# Altium project MiniKey.PrjPCB
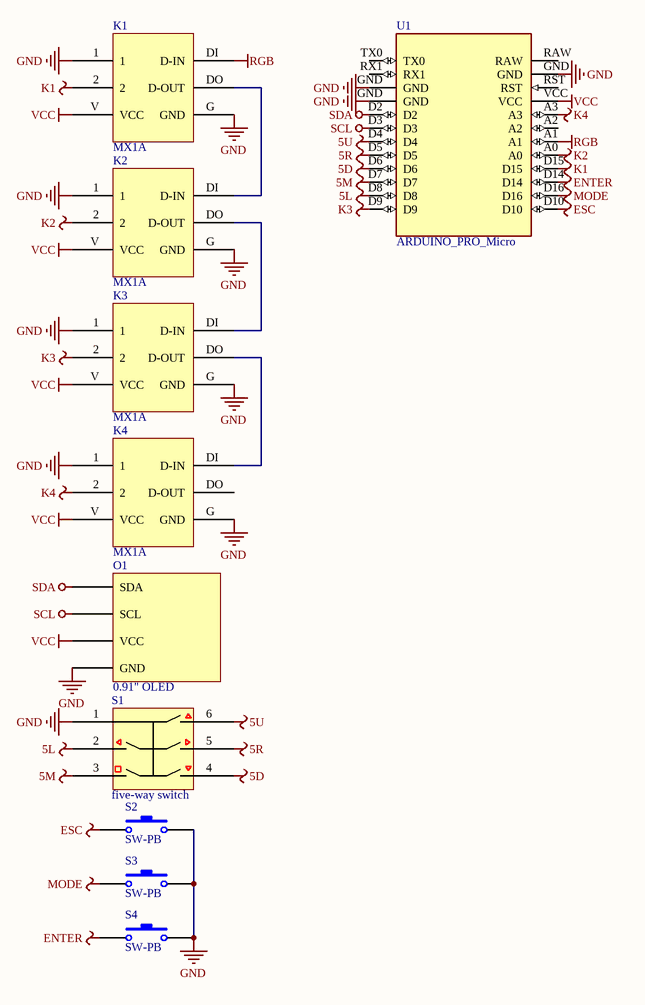
[diagram p0: MiniKey.SchDoc]
1 sheet, 10 parts. Net scope: global (net labels, ports and power ports of the same name join across sheets).
Board file: MiniKey.PcbDoc

## Sheet MiniKey.SchDoc
size A4

### Parts
K1  MX1A  [MX1A]
K2  MX1A  [MX1A]
K3  MX1A  [MX1A]
K4  MX1A  [MX1A]
O1  0.91" OLED  [0.91-OLED]
S1  five-way switch  [five-way switch]
S2  SW-PB  [SW_PB2_A1]
S3  SW-PB  [SW_PB2_A1]
S4  SW-PB  [SW_PB2_A1]
U1  ARDUINO_PRO_Micro  [MODULE_ARDUINO_PRO_MINI]

### Nets
5D: S1.4 U1.D6
5L: S1.2 U1.D8
5M: S1.3 U1.D7
5R: S1.5 U1.D5
5U: S1.6 U1.D4
ENTER: S4.1 U1.D14
ESC: S2.1 U1.D10
GND: K1.1 K1.G(GND) K2.1 K2.G(GND) K3.1 K3.G(GND) K4.1 K4.G(GND) O1.GND S1.1 S2.2 S3.2 S4.2 U1.GND
K1: K1.2 U1.D15
K2: K2.2 U1.A0
K3: K3.2 U1.D9
K4: K4.2 U1.A3
MODE: S3.1 U1.D16
RGB: K1.DI(D-IN) U1.A1
SCL: O1.SCL U1.D3
SDA: O1.SDA U1.D2
VCC: K1.V(VCC) K2.V(VCC) K3.V(VCC) K4.V(VCC) O1.VCC U1.VCC
NetK1_DO: K1.DO(D-OUT) K2.DI(D-IN)
NetK2_DO: K2.DO(D-OUT) K3.DI(D-IN)
NetK3_DO: K3.DO(D-OUT) K4.DI(D-IN)

Not connected (* = marked no-connect by the designer): K4 DO(D-OUT); U1 A2 RAW RST RX1 TX0

### Library data of the parts
S2-S4 = SW-PB: 峚雄羲壽; Published: 24-Mar-1999; LatestRevisionDate: 17-Jul-2002; LatestRevisionNote: Re-released for DXP Platform.; PackageReference: SPST-2; Publisher: Altium Limited
U1 = ARDUINO_PRO_Micro: ATmega328 Arduino Pro Mini 328 5V/16MHz AVRÂ® ATmega AVR MCU 8-Bit Embedded Evaluation Board; MF: SparkFun Electronics; Availability: Unavailable; SnapEDA_Link: https://www.snapeda.com/parts/ARDUINO%20PRO%20MINI/SparkFun%20Electronics/view-part/2828730/?ref=snap; Value: *; MP: ARDUINO PRO MINI; Package: Package; Price: None